# Altium project 四版主控.PrjPcb
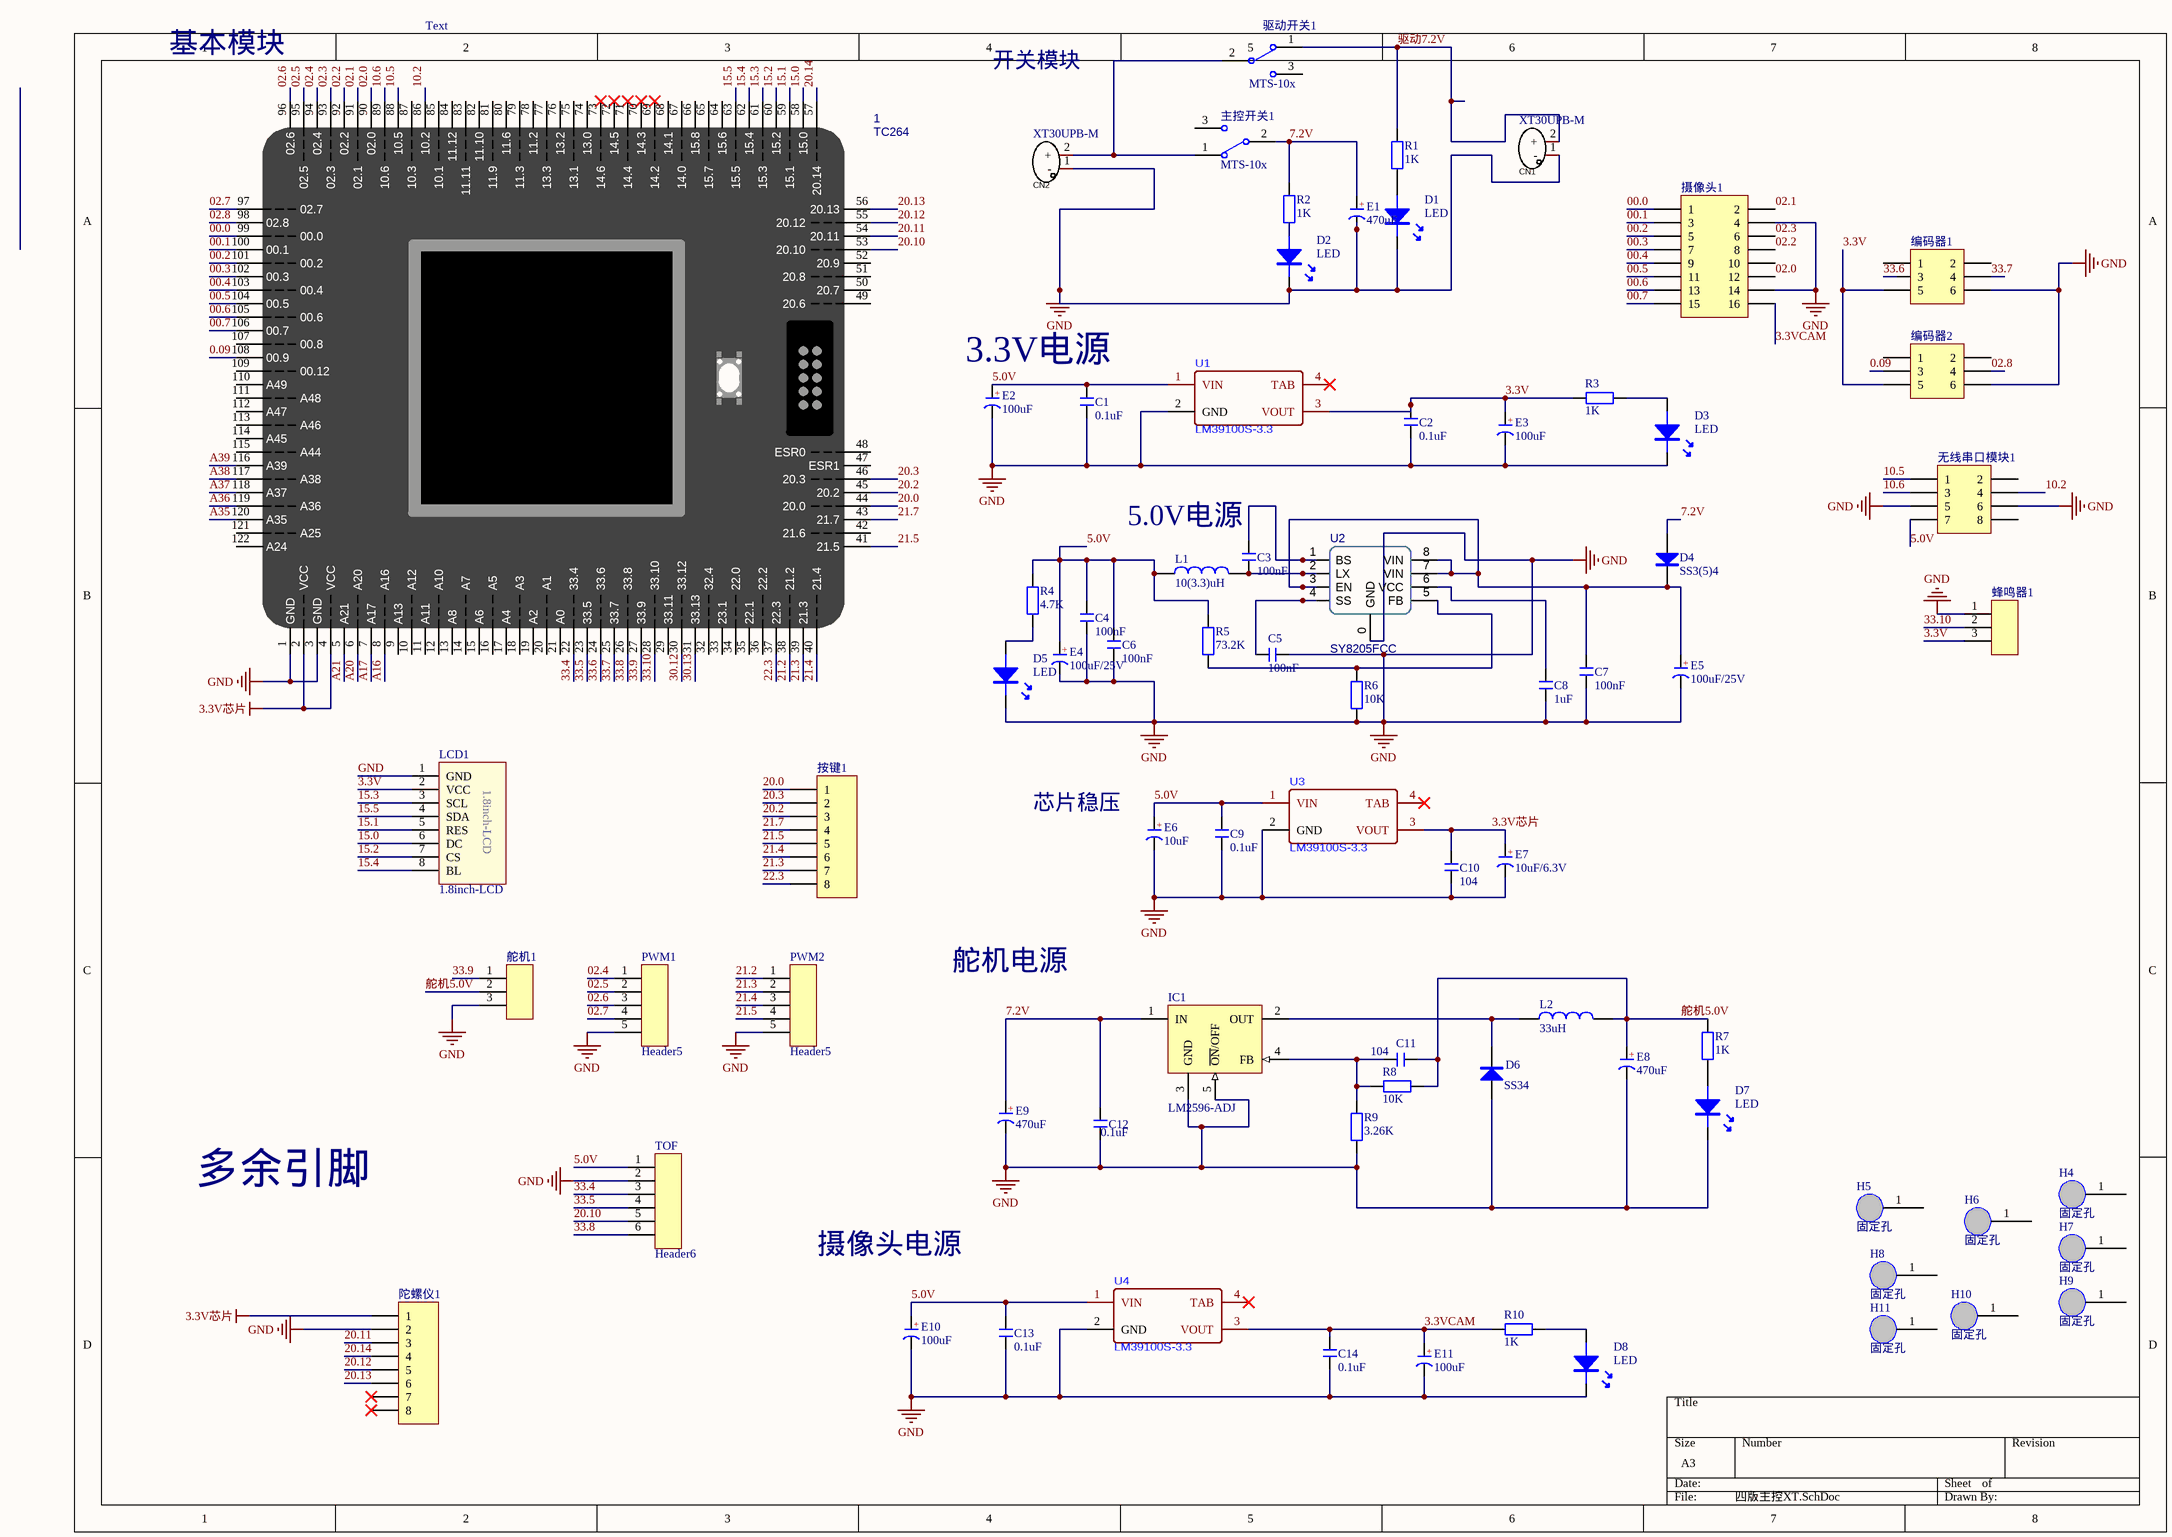
[diagram p0: 四版主控XT.SchDoc]
1 sheet, 75 parts. Net scope: global (net labels, ports and power ports of the same name join across sheets).
Board file: 四版主控XT.PcbDoc

## Sheet 四版主控XT.SchDoc
size A3; SheetNumber: 1; SheetTotal: 1

### Parts
1  TC264  [TC264_CoreBoard]
C1  0.1uF  [C 0805_L]
C2  0.1uF  [C 0805_L]
C3  100nF  [C 0805_L]
C4  100nF  [C 0805_L]
C5  100nF  [C 0805_L]
C6  100nF  [C 0805_L]
C7  100nF  [C 0805_L]
C8  1uF  [C 0805_L]
C9  0.1uF  [C 0805_L]
C10  104  [C 0805_L]
C11  104  [C 0805_L]
C12  0.1uF  [C 0805_L]
C13  0.1uF  [C 0805_L]
C14  0.1uF  [C 0805_L]
CN1  XT30UPB-M  [PCBComponent_1 - duplicate]
CN2  XT30UPB-M  [PCBComponent_1 - duplicate]
D1  LED  [LED-0805R]
D2  LED  [LED-0805R]
D3  LED  [LED-0805R]
D4  SS3(5)4  [SMC]
D5  LED  [LED-0805R]
D6  SS34  [SMC]
D7  LED  [LED-0805R]
D8  LED  [LED-0805R]
E1  470uF  [CAP 5.0*10*16]
E2  100uF  [CD A(3216)]
E3  100uF  [CD A(3216)]
E4  100uF/25V  [CAP 2.5*5*11]
E5  100uF/25V  [CAP 2.5*5*11]
E6  10uF  [CD A(3216)]
E7  10uF/6.3V  [CD A(3216)]
E8  470uF  [CAP 5.0*10*16]
E9  470uF  [CAP 5.0*10*16]
E10  100uF  [CD A(3216)]
E11  100uF  [CD A(3216)]
H4  固定孔  [M3-MountHole-Plated]  (no BOM)
H5  固定孔  [M3-MountHole-Plated]  (no BOM)
H6  固定孔  [M3-MountHole-Plated]  (no BOM)
H7  固定孔  [M3-MountHole-Plated]  (no BOM)
H8  固定孔  [M3-MountHole-Plated]  (no BOM)
H9  固定孔  [M3-MountHole-Plated]  (no BOM)
H10  固定孔  [M3-MountHole-Plated]  (no BOM)
H11  固定孔  [M3-MountHole-Plated]  (no BOM)
IC1  LM2596-ADJ  [TO263-5A]
L1  10(3.3)uH  [CD73]
L2  33uH  [CDRH127]
LCD1  1.8inch-LCD  [1.8inch-LCD]
PWM1  Header5  [JP5]
PWM2  Header5  [JP5]
R1  1K  [R 0805_L]
R2  1K  [R 0805_L]
R3  1K  [R 0805_L]
R4  4.7K  [R 0805_L]
R5  73.2K  [R 0805_L]
R6  10K  [R 0805_L]
R7  1K  [R 0805_L]
R8  10K  [R 0805_L]
R9  3.26K  [R 0805_L]
R10  1K  [R 0805_L]
TOF  Header6  [JP6]
U1  LM39100S-3.3  [SOT-223_L6.5-W3.5-P2.30-LS7.0-BR]
U2  SY8205FCC  [SOP-8E]
U3  LM39100S-3.3  [SOT-223_L6.5-W3.5-P2.30-LS7.0-BR]
U4  LM39100S-3.3  [SOT-223_L6.5-W3.5-P2.30-LS7.0-BR]
主控开关1  MTS-10x  [MTS-10x]
按键1  (no value)  [JP8]
摄像头1  摄像头  [IDC16]  (value not drawn)
无线串口模块1  (no value)  [HDR2X4]
编码器1  编码器1  [HDR2X3]  (value not drawn)
编码器2  编码器2  [HDR2X3]  (value not drawn)
舵机1  (no value)  [JP3]
蜂鸣器1  (no value)  [JP3]
陀螺仪1  (no value)  [HDR1X8]
驱动开关1  MTS-10x  [MTS-10x]

### Nets
3.3V芯片: 1.2(VCC) 1.4(VCC) C10.2 E7.1(A) U3.3(VOUT) 陀螺仪1.1
GND: 1.1(GND) 1.3(GND) C1.1 C2.1 C4.1 C5.2 C6.1 C7.1 C8.1 C9.1 C10.1 C12.2 C13.1 C14.1 CN1.1(-) CN2.1(-) D1.K D2.K D3.K D5.K D6.1(A) D7.K D8.K E1.2(K) E2.2(K) E3.2(K) E4.2(K) E5.2(K) E6.2(K) E7.2(K) E8.2(K) E9.2(K) E10.2(K) E11.2(K) IC1.3(GND) IC1.5(~{ON}/OFF) LCD1.1(GND) PWM1.5 PWM2.5 R6.1 R9.1 TOF.2 U1.2(GND) U2.0(GND) U3.2(GND) U4.2(GND) 摄像头1.4 摄像头1.14 无线串口模块1.5 无线串口模块1.6 编码器1.6 编码器2.6 舵机1.3 蜂鸣器1.1 陀螺仪1.2
00.0: 1.99(00.0) 摄像头1.1
00.1: 1.100(00.1) 摄像头1.3
00.2: 1.101(00.2) 摄像头1.5
00.3: 1.102(00.3) 摄像头1.7
00.4: 1.103(00.4) 摄像头1.9
00.5: 1.104(00.5) 摄像头1.11
00.6: 1.105(00.6) 摄像头1.13
00.7: 1.106(00.7) 摄像头1.15
0.09: 1.108(00.9) 编码器2.3
02.0: 1.90(02.0) 摄像头1.12
02.1: 1.91(02.1) 摄像头1.2
02.2: 1.92(02.2) 摄像头1.8
02.3: 1.93(02.3) 摄像头1.6
02.4: 1.94(02.4) PWM1.1
02.5: 1.95(02.5) PWM1.2
02.6: 1.96(02.6) PWM1.3
02.7: 1.97(02.7) PWM1.4
02.8: 1.98(02.8) 编码器2.4
3.3V: C2.2 E3.1(A) LCD1.2(VCC) R3.1 U1.3(VOUT) 编码器1.5 编码器2.5 蜂鸣器1.3
3.3VCAM: C14.2 E11.1(A) R10.1 U4.3(VOUT) 摄像头1.16
5.0V: C1.2 C4.2 C6.2 C9.2 C13.2 E2.1(A) E4.1(A) E6.1(A) E10.1(A) L1.1 R4.2 R5.2 TOF.1 U1.1(VIN) U3.1(VIN) U4.1(VIN) 无线串口模块1.7
7.2V: C12.1 D4.1(A) E1.1(A) E9.1(A) IC1.1(IN) R2.1 主控开关1.2
10.2: 1.86(10.2) 无线串口模块1.4
10.5: 1.88(10.5) 无线串口模块1.1
10.6: 1.89(10.6) 无线串口模块1.3
15.0: 1.58(15.0) LCD1.6(DC)
15.1: 1.59(15.1) LCD1.5(RES)
15.2: 1.60(15.2) LCD1.7(CS)
15.3: 1.61(15.3) LCD1.3(SCL)
15.4: 1.62(15.4) LCD1.8(BL)
15.5: 1.63(15.5) LCD1.4(SDA)
20.0: 1.44(20.0) 按键1.1
20.2: 1.45(20.2) 按键1.3
20.3: 1.46(20.3) 按键1.2
20.10: 1.53(20.10) TOF.5
20.11: 1.54(20.11) 陀螺仪1.3
20.12: 1.55(20.12) 陀螺仪1.5
20.13: 1.56(20.13) 陀螺仪1.6
20.14: 1.57(20.14) 陀螺仪1.4
21.2: 1.38(21.2) PWM2.1
21.3: 1.39(21.3) PWM2.2 按键1.7
21.4: 1.40(21.4) PWM2.3 按键1.6
21.5: 1.41(21.5) PWM2.4 按键1.5
21.7: 1.43(21.7) 按键1.4
22.3: 1.37(22.3) 按键1.8
30.12: 1.30(33.12)
30.13: 1.31(33.13)
33.4: 1.22(33.4) TOF.3
33.5: 1.23(33.5) TOF.4
33.6: 1.24(33.6) 编码器1.3
33.7: 1.25(33.7) 编码器1.4
33.8: 1.26(33.8) TOF.6
33.9: 1.27(33.9) 舵机1.1
33.10: 1.28(33.10) 蜂鸣器1.2
A16: 1.8(A16)
A17: 1.7(A17)
A20: 1.6(A20)
A21: 1.5(A21)
A35: 1.120(A35)
A36: 1.119(A36)
A37: 1.118(A37)
A38: 1.117(A38)
A39: 1.116(A39)
舵机5.0V: C11.2 E8.1(A) L2.2 R7.2 R8.2 舵机1.2
驱动7.2V: CN1.2(+) R1.1 驱动开关1.1
NetC3_1: C3.1 L1.2 U2.2(LX)
NetC3_2: C3.2 U2.1(BS)
NetC5_1: C5.1 U2.4(SS)
NetC7_2: C7.2 D4.2(K) E5.1(A) U2.3(EN) U2.7(VIN) U2.8(VIN)
NetC8_2: C8.2 U2.6(VCC)
NetC11_1: C11.1 IC1.4(FB) R8.1 R9.2
NetCN2_2: CN2.2(+) 主控开关1.1 驱动开关1.2
NetD1_A: D1.A R1.2
NetD2_A: D2.A R2.2
NetD3_A: D3.A R3.2
NetD5_A: D5.A R4.1
NetD6_2: D6.2(K) IC1.2(OUT) L2.1
NetD7_A: D7.A R7.1
NetD8_A: D8.A R10.2
NetR5_1: R5.1 R6.2 U2.5(FB)

Not connected (* = marked no-connect by the designer): 1 9(A13) 10(A12) 11(A11) 12(A10) 13(A8) 14(A7) 15(A6) 16(A5) 17(A4) 18(A3) 19(A2) 20(A1) 21(A0) 29(33.11) 32(32.4) 33(23.1) 34(22.0) 35(22.1) 36(22.2) 42(21.6) 47(ESR1) 48(ESR0) 49(20.6) 50(20.7) 51(20.8) 52(20.9) 64(15.6) 65(15.7) 66(15.8) 67(14.0) 68(14.1) 69(14.2)* 70(14.3)* 71(14.4)* 72(14.5)* 73(14.6)* 74(13.0) 75(13.1) 76(13.2) 77(13.3) 78(11.2) 79(11.3) 80(11.6) 81(11.9) 82(11.10) 83(11.11) 84(11.12) 85(10.1) 87(10.3) 107(00.8) 109(00.12) 110(A49) 111(A48) 112(A47) 113(A46) 114(A45) 115(A44) 121(A25) 122(A24); H4 1; H5 1; H6 1; H7 1; H8 1; H9 1; H10 1; H11 1; U1 4(TAB)*; U3 4(TAB)*; U4 4(TAB)*; 主控开关1 3; 摄像头1 10; 无线串口模块1 2 8; 编码器1 1 2; 编码器2 1 2; 陀螺仪1 7* 8*; 驱动开关1 3

### Notes on the sheet
- 基本模块
- Text
- 开关模块
- 3.3V电源
- 5.0V电源
- 芯片稳压
- 舵机电源
- 多余引脚
- 摄像头电源
- (in symbol C-CAP) +
- (in symbol C-CD) +
- (in symbol C-CM) +

### Library data of the parts
1 = TC264_CoreBoard: 逐飞科技TC264核心板
C1-C14 = C: 无极性贴片电容; 版权归属: 源创客; BOM名称: 无极性贴片电容; 学习资源: www.ooocke.com
CN1 CN2 = XT30UPB-M: Manufacturer: AMASS(艾迈斯); Add into BOM: yes; Brand: 艾迈斯; RatedVoltage: DC 500V; InterfaceType: 公头; MetalMaterial: 镀金; InsulationMaterial: PA; RatedCurrent: 15A; contact resistance: 0.65mΩ; Symbol: XT30UPB-M; Device: XT30UPB-M; Supplier: LCSC; Supplier Part: C428721; Manufacturer Part: XT30UPB-M; JLCPCB Part Class: Extended Part; LCSC Part Name: AMASS(艾迈斯)板载立式 航模锂电池控制器连接器插头 公头XT30UPB-M; Supplier Footprint: -; Datasheet: https://atta.szlcsc.com/upload/public/pdf/source/20230412/7B5DFEF57C9EA5273853390C734B3AC5.pdf; Convert to PCB: yes; Model: XT30UPB-M; Power: -; Output: -; Input: -; Size: -; Interface: -; Type: 航模插头; Colour: 黄色; MaximumCurrent: -; Type1: -; NumberOfUSBHoles: -; RecommendedWireGauge: -; FlameRetardantGrade: -; Belt length: -; specifications: -
D4 D6 = SS34: 肖特基二极管; 版权归属: 源创客; 属性: 40V/3A; BOM名称: 肖特基二极管; 学习资源: www.ooocke.com
E1 E8 E9 = C-CAP: 直插电解电容; 版权归属: 源创客; BOM名称: 直插电解电容; 学习资源: www.ooocke.com
E2 E3 E6 E7 E10 E11 = C-CD: 贴片钽电容; 版权归属: 源创客; BOM名称: 贴片钽电容; 学习资源: www.ooocke.com
E4 E5 = C-CM: 贴片电解电容; 版权归属: 源创客; BOM名称: 贴片电解电容; 学习资源: www.ooocke.com
H4-H11 = MountHole
IC1 = LM2596-ADJ: DC降压芯片; BOM名称: DC稳压芯片; 版权归属: 源创客; 学习资源: www.ooocke.com
L1 L2 = L: 小功率贴片电感; 版权归属: 源创客; BOM名称: 小功率贴片电感; 学习资源: www.ooocke.com
R1-R10 = R: 贴片电阻; 版权归属: 源创客; BOM名称: 贴片电阻; 学习资源: www.ooocke.com
U2 = SY8205FCC: 同步buck
主控开关1 驱动开关1 = MTS-10x: MTS10x系列3脚扭子开关; 版权归属: 源创客; BOM名称: MTS10x系列3脚扭子开关; 学习资源: www.ooocke.com
按键1 = Header8
摄像头1 = Header8X2
无线串口模块1 = Header 4X2: Header, 4-Pin, Dual row; LatestRevisionDate: 17-Jul-2002; LatestRevisionNote: Re-released for DXP Platform.; Publisher: Altium Limited
编码器1 编码器2 = Header 3X2: Header, 3-Pin, Dual row; LatestRevisionDate: 17-Jul-2002; LatestRevisionNote: Re-released for DXP Platform.; Publisher: Altium Limited
舵机1 蜂鸣器1 = Header3
陀螺仪1 = Header 8: Header, 8-Pin; LatestRevisionDate: 17-Jul-2002; LatestRevisionNote: Re-released for DXP Platform.; Publisher: Altium Limited